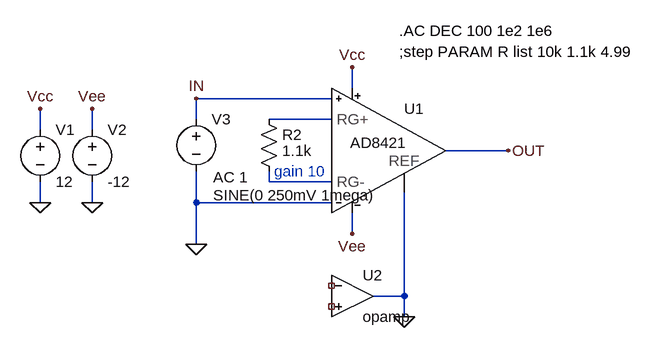
[diagram p0: schematic AD8421.asc]
AD8421.asc, the LTspice schematic file:
Version 4
SHEET 1 1148 680
WIRE 256 -32 256 -64
WIRE 224 -16 16 -16
WIRE 16 16 16 -16
WIRE 224 16 128 16
WIRE -224 32 -224 0
WIRE -144 32 -144 0
WIRE 496 64 400 64
WIRE 128 112 128 96
WIRE 224 112 128 112
WIRE -224 144 -224 112
WIRE -144 144 -144 112
WIRE 16 144 16 96
WIRE 224 144 16 144
WIRE 256 192 256 160
WIRE 16 208 16 144
WIRE 336 288 336 128
WIRE 336 288 288 288
WIRE 336 320 336 288
FLAG -224 144 0
FLAG -144 144 0
FLAG -224 0 Vcc
FLAG -144 0 Vee
FLAG 16 -16 IN
FLAG 496 64 OUT
FLAG 16 208 0
FLAG 256 -64 Vcc
FLAG 256 192 Vee
FLAG 336 320 0
SYMBOL voltage -224 16 R0
SYMATTR InstName V1
SYMATTR Value 12
SYMBOL voltage -144 16 R0
SYMATTR InstName V2
SYMATTR Value -12
SYMBOL res 112 0 R0
WINDOW 3 36 64 Left 2
SYMATTR InstName R2
SYMATTR Value 1.1k
SYMBOL voltage 16 0 R0
WINDOW 123 26 105 Left 2
WINDOW 39 0 0 Left 2
WINDOW 3 26 133 Left 2
SYMATTR Value2 AC 1
SYMATTR InstName V3
SYMATTR Value SINE(0 250mV 1mega)
SYMBOL AD8421 256 64 R0
SYMATTR InstName U1
SYMATTR SpiceModel LTC3.lib
SYMATTR Value2 LT1789-10
SYMATTR Description µPower, Single Supply Rail-to-Rail Output Instrumentation Amplifier
SYMBOL Opamps\\opamp 256 224 R0
SYMATTR InstName U2
TEXT 328 -120 Left 2 !.AC DEC 100 1e2 1e6
TEXT 328 -88 Left 2 !;step PARAM R list 10k 1.1k 4.99
TEXT 136 96 Left 2 ;gain 10

The netlist it stands for:
* AD8421.asc
V1 Vcc 0 12
V2 Vee 0 -12
R2 N001 N002 1.1k
V3 IN 0 SINE(0 250mV 1mega) AC 1
XU1 IN N001 N002 0 0 Vee OUT Vcc LT1789-10  ; pins IN- RG- RG+ IN+ -Vs REF Vout +Vs
XU2 NC_01 NC_02 0 opamp Aol=100K GBW=10Meg  ; pins invin noninvin out
.AC DEC 100 1e2 1e6
;step PARAM R list 10k 1.1k 4.99
* gain 10
.lib LTC3.lib
.backanno
.end